# EAGLE design arrayboard_r0 (EAGLE 7.3.0)
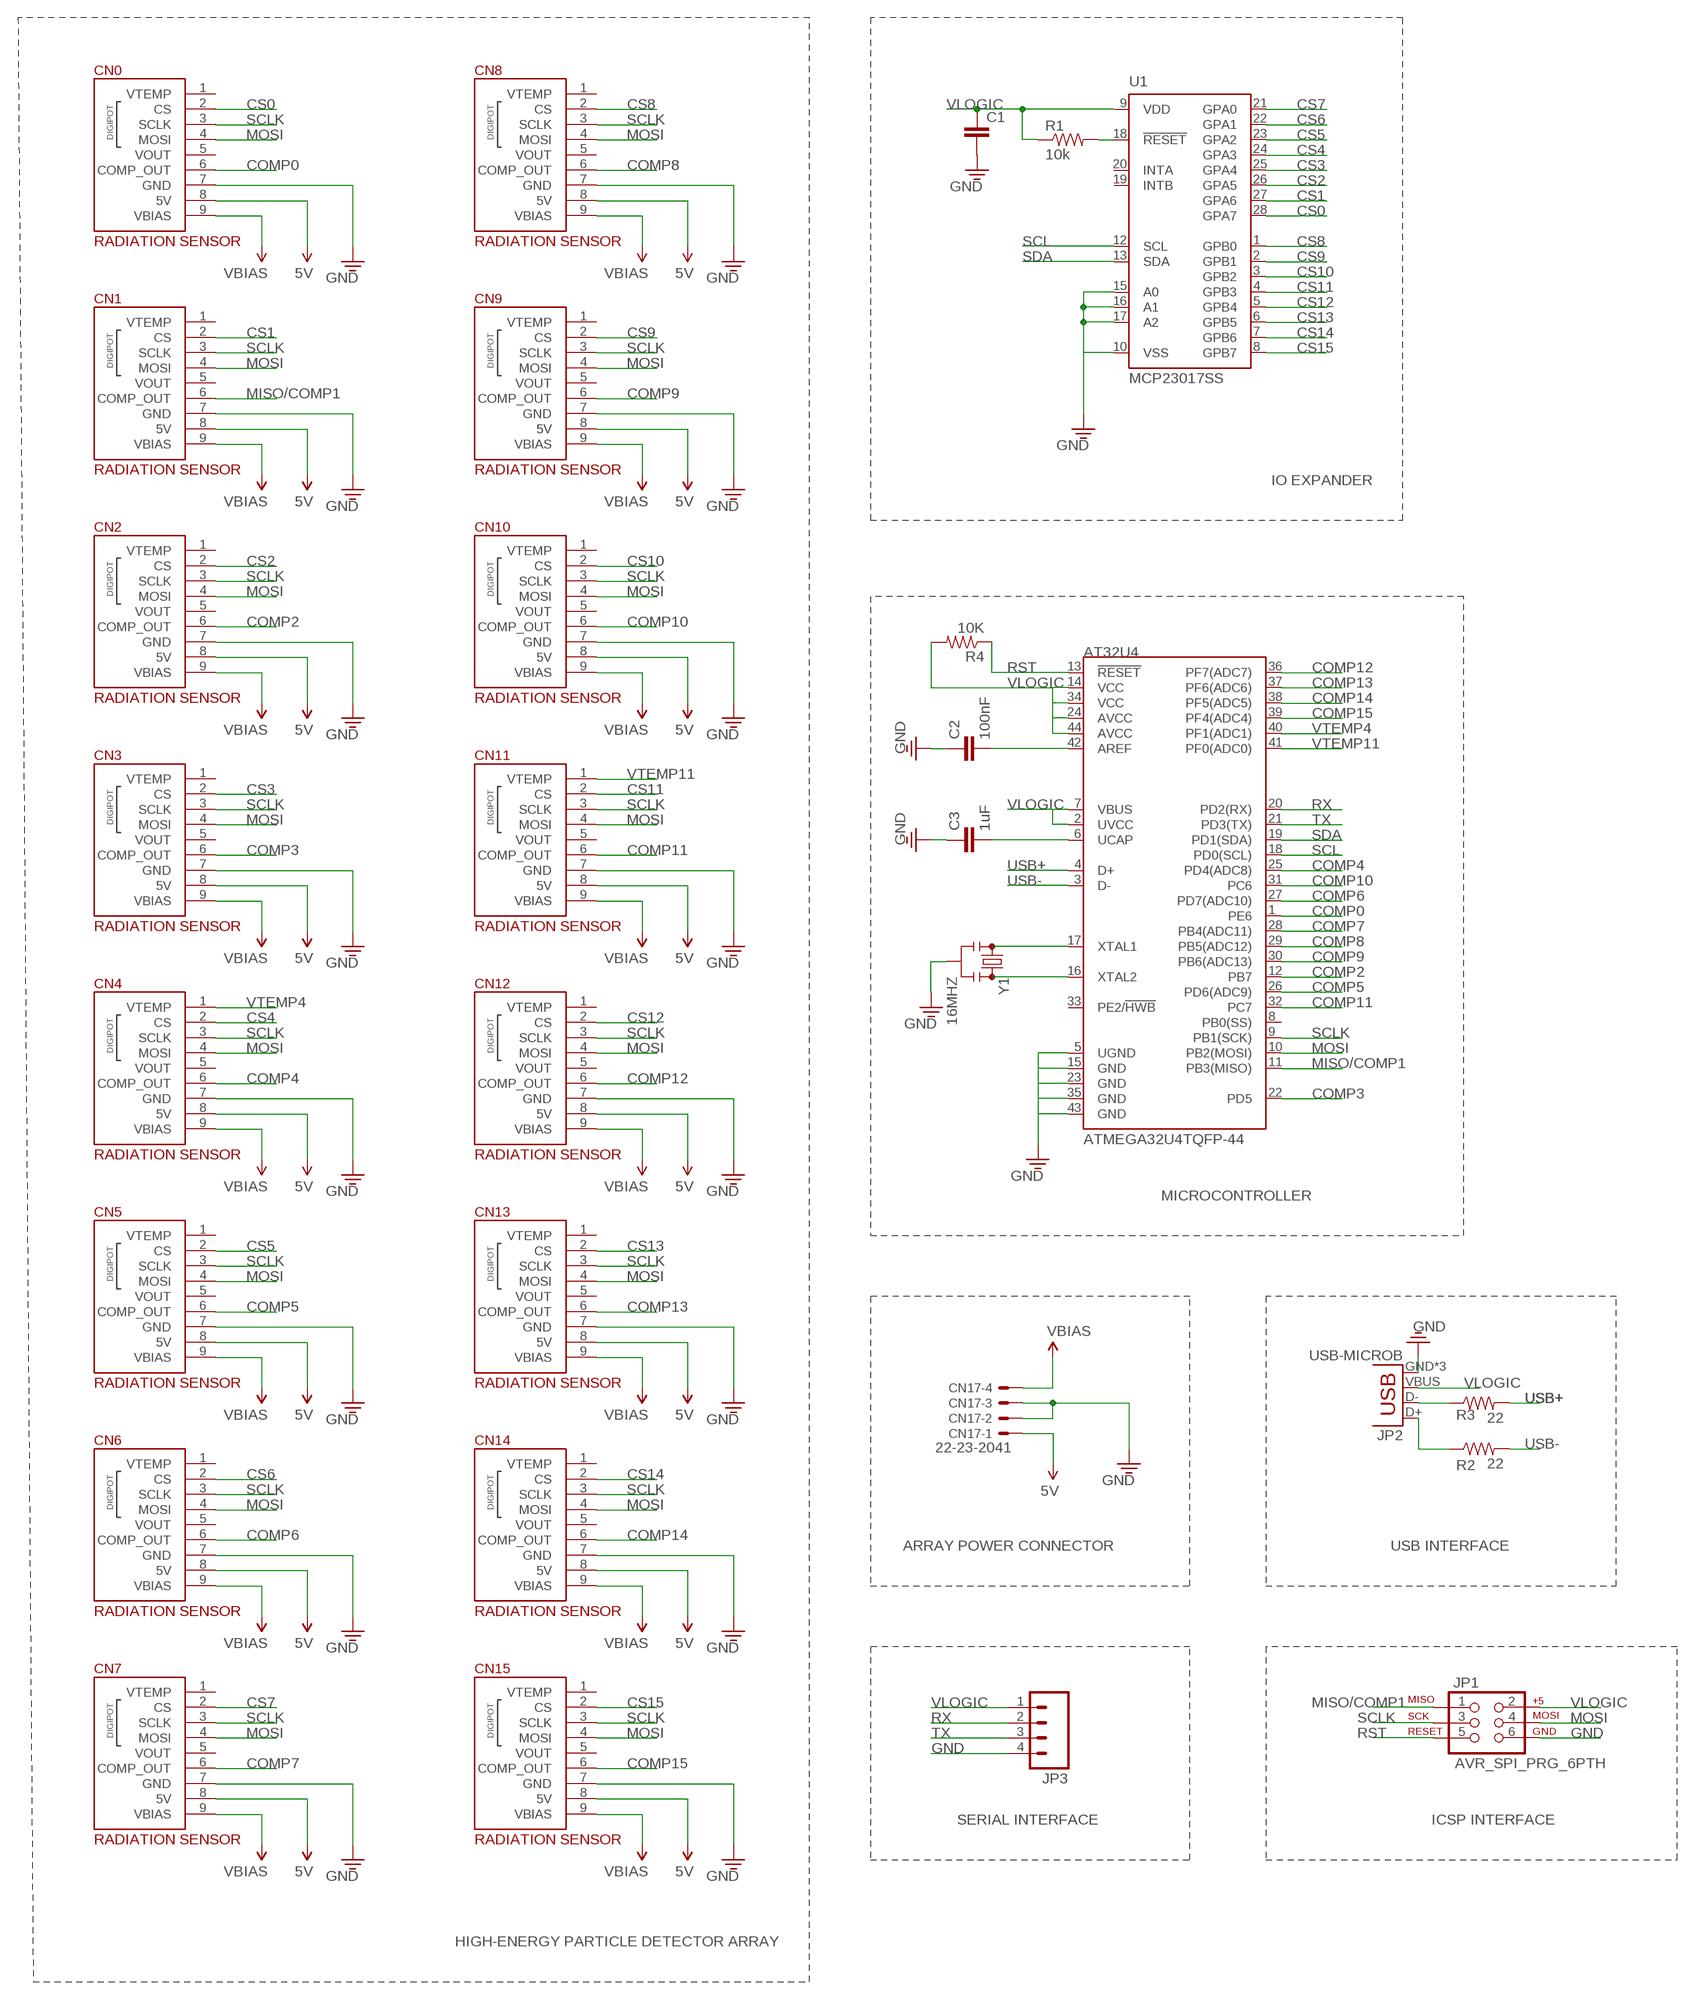
[diagram p0: schematic, sheet 1]

## Parts
AT32U4  ATMEGA32U4TQFP-44  [TQFP44]
C1  CAP0603  [0603]
C2  100nF  CAP0805  [0805]
C3  1uF  CAP0805  [0805]
CN0  RADIATION-SENSOR-REV1  [RADIATION-SENSOR-REV1]
CN1  RADIATION-SENSOR-REV1  [RADIATION-SENSOR-REV1]
CN2  RADIATION-SENSOR-REV1  [RADIATION-SENSOR-REV1]
CN3  RADIATION-SENSOR-REV1  [RADIATION-SENSOR-REV1]
CN4  RADIATION-SENSOR-REV1  [RADIATION-SENSOR-REV1]
CN5  RADIATION-SENSOR-REV1  [RADIATION-SENSOR-REV1]
CN6  RADIATION-SENSOR-REV1  [RADIATION-SENSOR-REV1]
CN7  RADIATION-SENSOR-REV1  [RADIATION-SENSOR-REV1]
CN8  RADIATION-SENSOR-REV1  [RADIATION-SENSOR-REV1]
CN9  RADIATION-SENSOR-REV1  [RADIATION-SENSOR-REV1]
CN10  RADIATION-SENSOR-REV1  [RADIATION-SENSOR-REV1]
CN11  RADIATION-SENSOR-REV1  [RADIATION-SENSOR-REV1]
CN12  RADIATION-SENSOR-REV1  [RADIATION-SENSOR-REV1]
CN13  RADIATION-SENSOR-REV1  [RADIATION-SENSOR-REV1]
CN14  RADIATION-SENSOR-REV1  [RADIATION-SENSOR-REV1]
CN15  RADIATION-SENSOR-REV1  [RADIATION-SENSOR-REV1]
CN17  22-23-2041  [22-23-2041]
JP1  AVR_SPI_PRG_6PTH  [2X3]
JP2  USB-MICROB  [USB-MICROB]
JP3  M04POLAR  [MOLEX-1X4]
R1  10k  RESISTOR0603  [0603]
R2  22  RESISTOR0805-RES  [0805]
R3  22  RESISTOR0805-RES  [0805]
R4  10K  RESISTOR0805-RES  [0805]
U1  MCP23017SS  [SSOP28]
Y1  16MHZ  RESONATOR16MHZ  [RESONATOR-SMD]

## Nets
5V: CN0.8(5V) CN1.8(5V) CN2.8(5V) CN3.8(5V) CN4.8(5V) CN5.8(5V) CN6.8(5V) CN7.8(5V) CN8.8(5V) CN9.8(5V) CN10.8(5V) CN11.8(5V) CN12.8(5V) CN13.8(5V) CN14.8(5V) CN15.8(5V) CN17.1
COMP0: AT32U4.1(PE6) CN0.6(COMP_OUT)
COMP2: AT32U4.12(PB7) CN2.6(COMP_OUT)
COMP3: AT32U4.22(PD5) CN3.6(COMP_OUT)
COMP4: AT32U4.25(PD4(ADC8)) CN4.6(COMP_OUT)
COMP5: AT32U4.26(PD6(ADC9)) CN5.6(COMP_OUT)
COMP6: AT32U4.27(PD7(ADC10)) CN6.6(COMP_OUT)
COMP7: AT32U4.28(PB4(ADC11)) CN7.6(COMP_OUT)
COMP8: AT32U4.29(PB5(ADC12)) CN8.6(COMP_OUT)
COMP9: AT32U4.30(PB6(ADC13)) CN9.6(COMP_OUT)
COMP10: AT32U4.31(PC6) CN10.6(COMP_OUT)
COMP11: AT32U4.32(PC7) CN11.6(COMP_OUT)
COMP12: AT32U4.36(PF7(ADC7)) CN12.6(COMP_OUT)
COMP13: AT32U4.37(PF6(ADC6)) CN13.6(COMP_OUT)
COMP14: AT32U4.38(PF5(ADC5)) CN14.6(COMP_OUT)
COMP15: AT32U4.39(PF4(ADC4)) CN15.6(COMP_OUT)
CS0: CN0.2(CS) U1.28(GPA7)
CS1: CN1.2(CS) U1.27(GPA6)
CS2: CN2.2(CS) U1.26(GPA5)
CS3: CN3.2(CS) U1.25(GPA4)
CS4: CN4.2(CS) U1.24(GPA3)
CS5: CN5.2(CS) U1.23(GPA2)
CS6: CN6.2(CS) U1.22(GPA1)
CS7: CN7.2(CS) U1.21(GPA0)
CS8: CN8.2(CS) U1.1(GPB0)
CS9: CN9.2(CS) U1.2(GPB1)
CS10: CN10.2(CS) U1.3(GPB2)
CS11: CN11.2(CS) U1.4(GPB3)
CS12: CN12.2(CS) U1.5(GPB4)
CS13: CN13.2(CS) U1.6(GPB5)
CS14: CN14.2(CS) U1.7(GPB6)
CS15: CN15.2(CS) U1.8(GPB7)
GND: AT32U4.5(UGND) AT32U4.15(GND) AT32U4.23(GND) AT32U4.35(GND) AT32U4.43(GND) C1.2 C2.1 C3.1 CN0.7(GND) CN1.7(GND) CN2.7(GND) CN3.7(GND) CN4.7(GND) CN5.7(GND) CN6.7(GND) CN7.7(GND) CN8.7(GND) CN9.7(GND) CN10.7(GND) CN11.7(GND) CN12.7(GND) CN13.7(GND) CN14.7(GND) CN15.7(GND) CN17.2 CN17.3 JP1.6 JP2.GND JP2.MT1(GND) JP2.MT2(GND) JP3.4 U1.10(VSS) U1.15(A0) U1.16(A1) U1.17(A2) Y1.2
MISO/COMP1: AT32U4.11(PB3(MISO)) CN1.6(COMP_OUT) JP1.1
MOSI: AT32U4.10(PB2(MOSI)) CN0.4(MOSI) CN1.4(MOSI) CN2.4(MOSI) CN3.4(MOSI) CN4.4(MOSI) CN5.4(MOSI) CN6.4(MOSI) CN7.4(MOSI) CN8.4(MOSI) CN9.4(MOSI) CN10.4(MOSI) CN11.4(MOSI) CN12.4(MOSI) CN13.4(MOSI) CN14.4(MOSI) CN15.4(MOSI) JP1.4
N$1: JP2.D- R3.1
N$2: R1.2 U1.18(!RESET)
N$3: JP2.D+ R2.1
N$4: AT32U4.6(UCAP) C3.2
N$5: AT32U4.17(XTAL1) Y1.1
N$6: AT32U4.2(UVCC)
N$7: AT32U4.16(XTAL2) Y1.3
N$9: AT32U4.42(AREF) C2.2
RST: AT32U4.13(!RESET) JP1.5 R4.1
RX: AT32U4.20(PD2(RX)) JP3.2
SCL: AT32U4.18(PD0(SCL)) U1.12(SCL)
SCLK: AT32U4.9(PB1(SCK)) CN0.3(SCLK) CN1.3(SCLK) CN2.3(SCLK) CN3.3(SCLK) CN4.3(SCLK) CN5.3(SCLK) CN6.3(SCLK) CN7.3(SCLK) CN8.3(SCLK) CN9.3(SCLK) CN10.3(SCLK) CN11.3(SCLK) CN12.3(SCLK) CN13.3(SCLK) CN14.3(SCLK) CN15.3(SCLK) JP1.3
SDA: AT32U4.19(PD1(SDA)) U1.13(SDA)
TX: AT32U4.21(PD3(TX)) JP3.3
USB+: AT32U4.4(D+) R3.2
USB-: AT32U4.3(D-) R2.2
VBIAS: CN0.9(VBIAS) CN1.9(VBIAS) CN2.9(VBIAS) CN3.9(VBIAS) CN4.9(VBIAS) CN5.9(VBIAS) CN6.9(VBIAS) CN7.9(VBIAS) CN8.9(VBIAS) CN9.9(VBIAS) CN10.9(VBIAS) CN11.9(VBIAS) CN12.9(VBIAS) CN13.9(VBIAS) CN14.9(VBIAS) CN15.9(VBIAS) CN17.4
VLOGIC: AT32U4.7(VBUS) AT32U4.14(VCC) AT32U4.24(AVCC) AT32U4.34(VCC) AT32U4.44(AVCC) C1.1 JP1.2 JP2.VBUS JP3.1 R1.1 R4.2 U1.9(VDD)
VTEMP4: AT32U4.40(PF1(ADC1)) CN4.1(VTEMP)
VTEMP11: AT32U4.41(PF0(ADC0)) CN11.1(VTEMP)
Unconnected: AT32U4.8(PB0(SS)) AT32U4.33(PE2/!HWB) CN0.1(VTEMP) CN0.5(VOUT) CN1.1(VTEMP) CN1.5(VOUT) CN2.1(VTEMP) CN2.5(VOUT) CN3.1(VTEMP) CN3.5(VOUT) CN4.5(VOUT) CN5.1(VTEMP) CN5.5(VOUT) CN6.1(VTEMP) CN6.5(VOUT) CN7.1(VTEMP) CN7.5(VOUT) CN8.1(VTEMP) CN8.5(VOUT) CN9.1(VTEMP) CN9.5(VOUT) CN10.1(VTEMP) CN10.5(VOUT) CN11.5(VOUT) CN12.1(VTEMP) CN12.5(VOUT) CN13.1(VTEMP) CN13.5(VOUT) CN14.1(VTEMP) CN14.5(VOUT) CN15.1(VTEMP) CN15.5(VOUT) U1.19(INTB) U1.20(INTA)

## Notes on the sheet
- IO EXPANDER
- MICROCONTROLLER
- ARRAY POWER CONNECTOR | USB INTERFACE
- SERIAL INTERFACE | ICSP INTERFACE
- HIGH-ENERGY PARTICLE DETECTOR ARRAY

## Library data of the parts
AT32U4 = SparkFun-DigitalIC:ATMEGA32U4: Atmel 44-pin 8-bit Microcontroller with 32KBytes of ISP Flash and USB Controller
C1 = openct:CAP: Capacitor Standard 0603 ceramic capacitor, and 0.1" leaded capacitor.
C2 C3 = SparkFun-Passives:CAP: Capacitor Standard 0603 ceramic capacitor, and 0.1" leaded capacitor.
CN0 CN1-CN15 = openct:RADIATION-SENSOR-REV1: Header for Radiation Sensor (rev1)
CN17 = con-molex:22-23-2041: .100" (2.54mm) Center Header - 4 Pin; MF: MOLEX; MPN: 22-23-2041; OC_FARNELL: 1462920; OC_NEWARK: 38C0355
JP1 = SparkFun-Connectors:AVR_SPI_PRG_6: AVR ISP 6 Pin This is the reduced ISP connector for AVR programming. Common on Arduino. This footprint will take up less PCB space and can be used with a 10-pin to 6-pin adapter such as SKU: BOB-08508 **Special note about "TEST_POINT" package. The stop mask is on the top side, so if you want your programming test points to be on the bottom of your board, make sure to place this package on the bottom side of the board. This also ensure that the orientation to program from the bottom side will be correct.
JP2 = SparkFun-Connectors:USB: USB Connectors USB-B-PTH is fully proven SKU : PRT-00139/CONN-08278 USB-miniB is fully proven SKU : PRT-00587 USB-A-PCB is untested. USB-A-H is throughly reviewed, but untested. Spark Fun Electronics SKU : PRT-00437 USB-B-SMT is throughly reviewed, but untested. Needs silkscreen touching up. USB-A-S has not been used/tested USB-MB-H has not been used/tested USB-MICROB has been used. CONN-09505; PROD_ID: CONN-09505
JP3 = SparkFun-Connectors:M04: Header 4 Standard 4-pin 0.1" header. Use with straight break away headers (SKU : PRT-00116), right angle break away headers (PRT-00553), swiss pins (PRT-00743), machine pins (PRT-00117), and female headers (PRT-00115). Molex polarized connector foot print use with SKU : PRT-08231 with associated crimp pins and housings. 1MM SMD Version SKU: PRT-10208
R1 = openct:RESISTOR: Resistor
R2-R4 = SparkFun-Passives:RESISTOR: Resistor
U1 = adafruit:MCP23017: http://ww1.microchip.com/downloads/en/DeviceDoc/21952a.pdf Source: http://ww1.microchip.com/downloads/en/DeviceDoc/21952a.pdf
Y1 = SparkFun-FreqCtrl:RESONATOR: Resonator Small SMD resonator. Used, eg, on the Arduino Pro/ Pro Mini boards. 8MHz- XTAL-08895 16MHz- XTAL-08900; PROD_ID: XTAL-08900

## Board
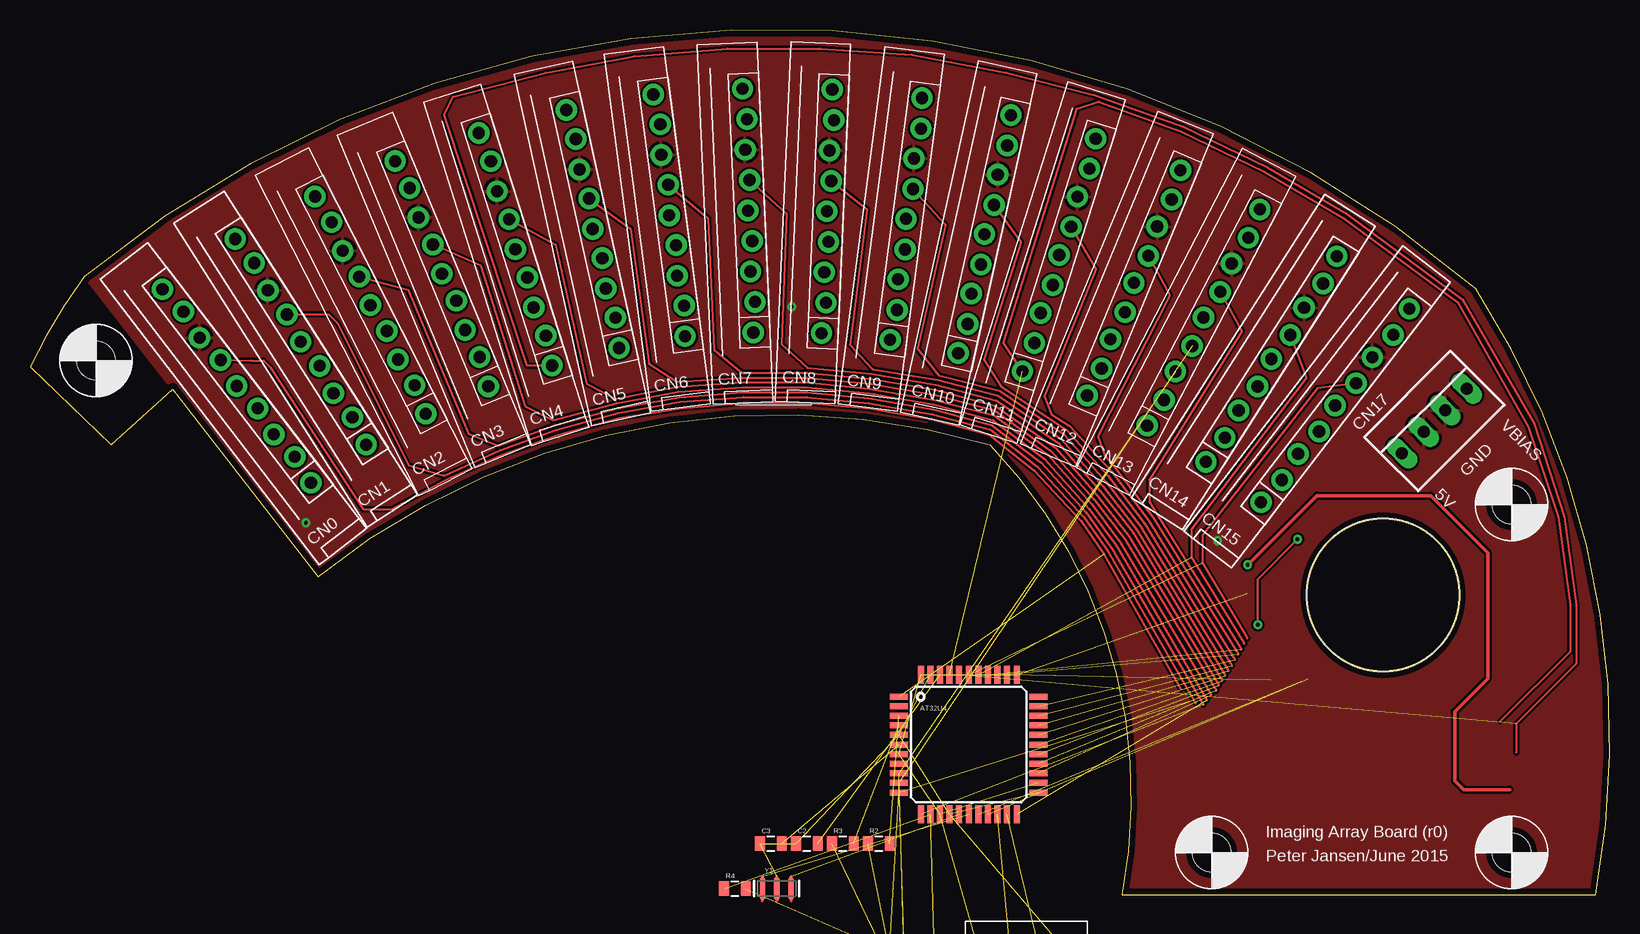
[diagram p1: board, top side]
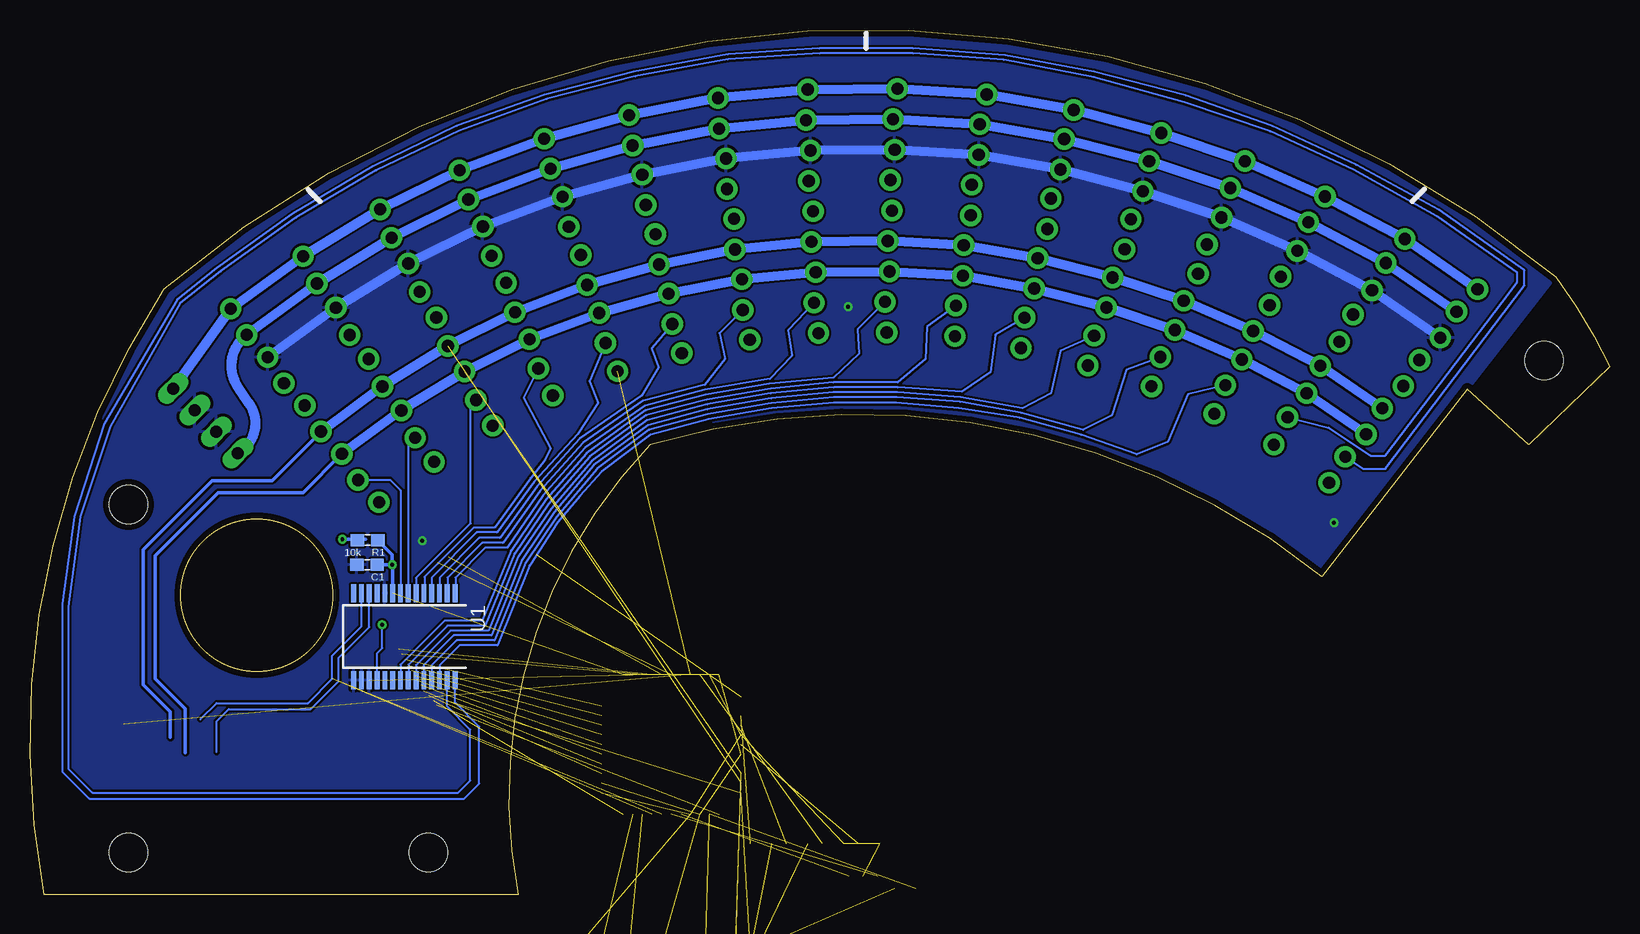
[diagram p2: board, bottom side, seen from below]

Size 131.71 x 72.05 mm. Coordinates in mm from the lower left corner, seen from the top.
Outline: 4.5,51.5 arc10 0,44 6.75,37.5 11.9,42.1 24,26.5 arc-55 80,37.5 arc-55 91,0 130.5,0 arc44 120.5,50.5 arc80 4.5,51.5
Outline: circle at 112.8,24.95 radius 6.35
Copper layers (1*16): Top 0.035mm / dielectric 1.5mm / Bottom 0.035mm
Design rules "default *": minimum track width 7mil, minimum drill 13mil, track to track 7mil, track to pad 8mil, pad to pad 8mil, via to via 8mil, smd to smd 8mil, copper to edge 20mil, drill to drill 8mil, minimum pad ring 10mil, minimum via ring 8mil, stop-mask expansion 4mil, vias tented up to drill 0mil, thermal gap 10mil
tKeepout: area 106.5,18.6 to 119.1,31.3
bKeepout: area 106.5,18.6 to 119.1,31.3; area 106.5,18.6 to 119.1,31.3; area 106.5,18.6 to 119.1,31.3
bRestrict: area 106.5,18.6 to 119.1,31.3

### Footprints (pad centres in the part's own frame; a part is rotated, then mirrored left to right if it is on the bottom)
TQFP44 = smd 1.5 x 0.5: 1 -5.8,4; 2 -5.8,3.2; 3 -5.8,2.4; 4 -5.8,1.6; 5 -5.8,0.8; 6 -5.8,0; 7 -5.8,-0.8; 8 -5.8,-1.6; 9 -5.8,-2.4; 10 -5.8,-3.2; 11 -5.8,-4; 23 5.8,-4; 24 5.8,-3.2; 25 5.8,-2.4; 26 5.8,-1.6; 27 5.8,-0.8; 28 5.8,0; 29 5.8,0.8; 30 5.8,1.6; 31 5.8,2.4; 32 5.8,3.2; 33 5.8,4 | smd 0.5 x 1.5: 12 -4,-5.8; 13 -3.2,-5.8; 14 -2.4,-5.8; 15 -1.6,-5.8; 16 -0.8,-5.8; 17 0,-5.8; 18 0.8,-5.8; 19 1.6,-5.8; 20 2.4,-5.8; 21 3.2,-5.8; 22 4,-5.8; 34 4,5.8; 35 3.2,5.8; 36 2.4,5.8; 37 1.6,5.8; 38 0.8,5.8; 39 0,5.8; 40 -0.8,5.8; 41 -1.6,5.8; 42 -2.4,5.8; 43 -3.2,5.8; 44 -4,5.8
0603 = smd 1.1 x 1: 1 -0.85,0; 2 0.85,0
0805 = smd 0.8 x 1.2: 1 -0.9,0; 2 0.9,0
RADIATION-SENSOR-REV1 = drill 1.016 pad 1.778: 1 9.16,1.123; 2 6.62,1.377; 3 4.08,1.123; 4 1.54,1.377; 5 -1,1.123; 6 -3.54,1.377; 7 -6.08,1.123; 8 -8.62,1.377; 9 -11.16,1.123
22-23-2041 = drill 1 long: 1 -3.81,0; 2 -1.27,0; 3 1.27,0; 4 3.81,0
2X3 = drill 1.016 pad 1.88 octagon: 1 0,0; 2 0,2.54; 3 2.54,0; 4 2.54,2.54; 5 5.08,0; 6 5.08,2.54
USB-MICROB = smd 0.35 x 1.4: D+ 0,2.65; D- -0.65,2.65; GND 1.3,2.65; ID 0.65,2.65; VBUS -1.3,2.65 | smd 1.8 x 1.9: MT1 -4,0; MT2 4,0 | smd 1.9 x 1.9: P$1 -1.27,0; P$2 1.27,0
MOLEX-1X4 = drill 1.016 pad 1.88 square: 1 0,0 | drill 1.016 pad 1.88: 2 2.54,0; 3 5.08,0; 4 7.62,0
SSOP28 = smd 0.4 x 1.5: 1 -4.225,-3.625; 2 -3.575,-3.625; 3 -2.925,-3.625; 4 -2.275,-3.625; 5 -1.625,-3.625; 6 -0.975,-3.625; 7 -0.325,-3.625; 8 0.325,-3.625; 9 0.975,-3.625; 10 1.625,-3.625; 11 2.275,-3.625; 12 2.925,-3.625; 13 3.575,-3.625; 14 4.225,-3.625; 15 4.225,3.625; 16 3.575,3.625; 17 2.925,3.625; 18 2.275,3.625; 19 1.625,3.625; 20 0.975,3.625; 21 0.325,3.625; 22 -0.325,3.625; 23 -0.975,3.625; 24 -1.625,3.625; 25 -2.275,3.625; 26 -2.925,3.625; 27 -3.575,3.625; 28 -4.225,3.625
MOUNT-M3 = hole 3.2: 0,0
RESONATOR-SMD = smd 0.45 x 1.905: 1 -1.2,0; 2 0,0; 3 1.2,0

### Placement (x,y rotation side)
AT32U4  78.25,12.5 0 top
C1  103.61,27.49 180 bottom
C2  64.75,4.25 0 top
C3  61.75,4.25 0 top
CN0  16.95,40.9 307.5 top
CN1  22.15,44.62 302.5 top
CN2  27.83,47.72 297 top
CN3  33.67,50.38 292.5 top
CN4  39.69,52.48 287.5 top
CN5  46.02,54.25 282.5 top
CN6  52.3,55.47 277.5 top
CN7  58.77,55.95 272.5 top
CN8  65.26,55.99 267.5 top
CN9  71.78,55.47 262.5 top
CN10  78.26,54.3 257.5 top
CN11  84.41,52.69 252.5 top
CN12  90.6,50.48 247.5 top
CN13  96.37,47.72 242.5 top
CN14  102,44.39 237.5 top
CN15  107.3,40.64 232.5 top
CN17  117.07,39.47 45 top
JP1  70.75,-19.5 0 top  (outside the outline)
JP2  71.5,-6.75 0 top  (outside the outline)
JP3  79.25,-5.25 0 top  (outside the outline)
R1  103.56,29.54 180 bottom
R2  70.75,4.25 0 top
R3  67.75,4.25 0 top
R4  58.75,0.5 0 top
U1  100.5,21.5 180 bottom
U$35  [MOUNT-M3]  123.5,3.5 0 top
U$36  [MOUNT-M3]  98.5,3.5 0 top
U$37  [MOUNT-M3]  123.5,32.5 0 top
U$38  [MOUNT-M3]  5.5,44.5 0 top
Y1  62.25,0.5 0 top

### Tracks (layer width: path | path; a pad name or v marks a point on that pad's centre or on a via)
5V
  Bottom 0.8: CN0.8 CN1.8 CN2.8 CN3.8 CN4.8 CN5.8 CN6.8 CN7.8 CN8.8 CN9.8 CN10.8 CN11.8 CN12.8 CN13.8 CN14.8 CN15.8
  Bottom 0.813: CN15.8 arc-84 114.5,42.5 arc-7 113.5,41 arc97 CN17.1
COMP0  (1 unrouted)
  Top 0.178: CN0.6 18.42,44.5 19.49,44.5 20.04,43.95 27.76,32.11 30.15,32.11 34.67,34.55 39.34,36.63 44.07,38.31 49.2,39.73 54.28,40.55 59.51,41 64.69,41 69.92,40.55 75.16,39.63 79.98,38.31 83.69,35.36 87.6,31.15 89.53,28.35 95.93,17.13
COMP2  (1 unrouted)
  Top 0.178: CN2.6 31.52,50.4 36.55,38.41 39.04,37.4 43.76,39.12 48.99,40.55 54.13,41.46 59.41,41.87 64.74,41.87 69.92,41.36 75.26,40.44 80.19,39.12 84.3,35.97 88.01,31.86 90.19,28.81 97.81,15.81
COMP3  (1 unrouted)
  Top 0.178: CN3.6 37.56,52.43 41.27,40.7 43.61,39.53 48.89,40.95 54.02,41.92 59.36,42.27 64.69,42.27 69.98,41.77 75.26,40.85 80.29,39.53 84.56,36.33 88.26,32.16 90.55,29.06 98.12,16.21
COMP4  (1 unrouted)
  Top 0.178: CN4.6 43.81,54.16 46.4,42.58 48.79,41.31 53.92,42.32 59.36,42.68 64.74,42.68 69.98,42.17 75.31,41.26 80.34,39.94 84.86,36.63 88.47,32.57 90.91,29.32 98.47,16.62
COMP5  (1 unrouted)
  Top 0.178: CN5.6 50.06,55.48 51.59,44.25 53.92,42.73 59.36,43.09 64.74,43.09 70.08,42.58 75.41,41.66 80.39,40.34 85.17,36.94 88.67,32.93 91.26,29.62 98.88,16.97
COMP6  (1 unrouted)
  Top 0.178: CN6.6 56.51,56.34 57.02,45.42 59.36,43.49 64.74,43.49 70.08,42.98 75.46,42.07 80.44,40.75 85.42,37.29 88.92,33.28 91.62,29.88 99.08,17.43
COMP7  (1 unrouted)
  Top 0.178: CN7.6 63.07,56.75 62.66,45.88 64.79,43.9 70.13,43.39 75.51,42.48 80.59,41.16 85.67,37.65 89.18,33.64 91.92,30.18 99.39,17.84
COMP8  (1 unrouted)
  Top 0.178: CN8.6 69.77,57.11 68.35,45.83 70.23,43.8 75.67,42.88 80.75,41.56 85.93,38.01 89.43,34.04 92.23,30.44 99.64,18.24
COMP9  (1 unrouted)
  Top 0.178: CN9.6 76.33,55.84 73.99,45.47 75.72,43.29 80.85,41.97 86.18,38.36 89.69,34.4 92.58,30.69 99.9,18.65
COMP10  (1 unrouted)
  Top 0.178: CN10.6 82.62,54.36 79.53,44.56 80.95,42.37 86.38,38.72 89.84,34.91 92.89,30.94 100.2,19.06
COMP11  (1 unrouted)
  Top 0.178: CN11.6 88.87,52.13 84.56,41.51 85.17,40.04 86.64,39.07 90.14,35.26 93.24,31.2 100.46,19.56
COMP12  (1 unrouted)
  Top 0.178: CN12.6 95.02,49.94 89.03,38.21 89.58,36.58 90.45,35.57 93.6,31.45 100.71,20.02
COMP13  (1 unrouted)
  Top 0.178: CN13.6 101.01,46.95 93.29,34.55 93.29,32.72 93.95,31.71 100.96,20.43
COMP14  (1 unrouted)
  Top 0.178: CN14.6 106.4,43.09 96.8,30.44 96.8,28.1 101.22,20.89
COMP15  (1 unrouted)
  Top 0.178: CN15.6 107.3,42.19 97.71,29.93 97.71,27.64 101.47,21.34
CS0
  Bottom 0.178: CN0.2 20.55,35.47 18.72,35.47 7.14,50.76 7.14,52.03 14.25,57.06 21.16,60.81 28.17,64.07 35.38,66.61 43,68.59 50.42,69.96 58.09,70.52 65.91,70.52 73.53,70.01 81.41,68.59 88.82,66.66 96.14,64.07 103.1,60.71 109.8,56.75 116.15,52.18 119.45,49.59 125.5,39.25 128,31.5 129,24.25 129,10.25 126.75,8 95.5,8 94.25,9.25 94.25,14 96.28,16.02 U1.28
CS1
  Bottom 0.178: CN1.2 23.44,38.92 19.94,36.58 18.72,36.58 8.3,50.25 7.75,51.01 7.75,51.82 14.45,56.55 21.36,60.41 28.32,63.61 35.48,66.05 43,68.13 50.52,69.55 58.09,70.11 65.86,70.11 73.53,69.6 81.25,68.18 88.62,66.3 95.93,63.66 102.84,60.36 109.55,56.39 115.8,51.92 119.2,49.28 125,39 127.5,31.5 128.5,24 128.5,10.5 126.5,8.5 96,8.5 95,9.5 95,13.75 96.92,15.67 U1.27
CS2
  Bottom 0.178: CN2.2 35.18,41.71 36.85,37.75 39.45,36.69 44.07,38.31 49.2,39.73 54.28,40.55 59.51,41 64.69,41 69.87,40.55 75.16,39.63 79.98,38.31 84.06,35.23 85.83,33.25 87.71,31.01 90.07,27.41 92.73,20.76 95.91,20.76 97.56,19.11 97.56,17.89 U1.26
CS3
  Bottom 0.178: CN3.2 40.31,43.75 41.53,39.94 43.91,38.72 49.1,40.14 54.18,41.05 59.46,41.46 64.69,41.46 69.92,40.95 75.21,40.04 80.08,38.72 84.45,35.47 87.81,31.5 90.4,27.64 92.99,21.19 96.14,21.19 98.22,19.11 U1.25
CS4
  Bottom 0.178: CN4.2 45.8,45.32 46.61,41.77 48.99,40.55 54.13,41.46 59.41,41.87 64.74,41.87 69.92,41.36 75.26,40.44 80.19,39.12 84.71,35.77 88.01,31.86 90.7,27.9 93.24,21.6 96.39,21.6 98.88,19.11 U1.24
CS5
  Bottom 0.178: CN5.2 51.23,46.64 51.64,43.54 54.02,41.92 59.36,42.27 64.69,42.27 69.98,41.77 75.26,40.85 80.29,39.53 84.89,36.13 88.26,32.16 91.01,28.15 93.5,22 96.65,22 99.53,19.12 U1.23
CS6
  Bottom 0.178: CN6.2 56.92,47.3 57.07,44.61 59.36,42.68 64.74,42.68 69.98,42.17 75.31,41.26 80.34,39.94 85.06,36.48 88.47,32.57 91.31,28.4 93.75,22.41 96.9,22.41 100.15,19.16 100.15,17.9 U1.22
CS7
  Bottom 0.178: CN7.2 62.71,47.1 62.61,45.07 64.74,43.09 70.08,42.58 75.41,41.66 80.39,40.34 85.32,36.79 88.67,32.93 91.62,28.66 94,22.82 97.15,22.82 100.81,19.16 100.81,17.89 U1.21
CS8
  Bottom 0.178: CN8.2 68.5,47.05 68.2,44.91 70.03,42.98 75.46,42.07 80.44,40.75 85.42,37.24 88.92,33.28 91.92,28.91 93.75,28.91 96.24,26.42 96.24,25.16 U1.1
CS9
  Bottom 0.178: CN9.2 74.24,46.79 73.79,44.66 75.46,42.48 80.59,41.16 85.62,37.65 89.18,33.64 92.28,29.32 94,29.32 96.9,26.42 96.9,25.15 U1.2
CS10
  Bottom 0.178: CN10.2 79.88,45.52 79.32,43.95 80.75,41.56 85.88,38.01 89.43,34.04 92.53,29.73 94.26,29.73 97.56,26.42 97.56,25.14 U1.3
CS11
  Bottom 0.178: CN11.2 85.06,42.78 84.35,41 86.08,38.36 89.69,34.4 92.78,30.18 94.46,30.18 98.22,26.42 U1.4
CS12
  Bottom 0.178: CN12.2 90.55,41.41 88.31,37.19 88.77,36.23 89.99,34.7 92.99,30.59 94.72,30.59 98.83,26.47 98.83,25.17 U1.5
CS13
  Bottom 0.178: U1.6 99.53,26.39 94.97,30.94 94.97,40.77 CN13.2
CS14
  Bottom 0.178: CN14.2 100.17,37.49 U1.7
CS15
  Bottom 0.178: CN15.2 101.68,34.55 100.81,33.69 100.81,25.14 U1.8
GND  (via drill 0.33)  (13 unrouted)
  Bottom 0.8: CN0.7 CN1.7 CN2.7 CN3.7 CN4.7 CN5.7 CN6.7 CN7.7 CN8.7 CN9.7 CN10.7 CN11.7 CN12.7 CN13.7 CN14.7 CN15.7
  other vias: 23,31 63.5,49 99,29.5
  pour Top: 4.5,51.5 24,26.5 arc-55 80,37.5 arc-55 91,0 130.5,0 arc44 120.5,50.5 arc80
  pour Bottom: 4.5,51.5 24,26.5 arc-55 80,37.5 arc-55 91,0 130.5,0 arc44 120.5,50.5 arc80
MISO/COMP1  (2 unrouted)
  Top 0.178: CN1.6 24.89,48.34 25.63,47.61 31.57,35.77 34.52,34.91 39.19,37.04 43.91,38.72 49.1,40.14 54.18,41.05 59.46,41.46 64.74,41.46 69.92,40.95 75.21,40.04 80.08,38.72 84,35.67 87.86,31.45 89.84,28.61 97,16.21 arc5 97.18,15.93
MOSI  (2 unrouted)
  Bottom 0.305: CN15.4 111.54,34.5 116.5,34.5 122.25,28.75 122.25,17.5 120,15.25 120,13.11
  Bottom 0.8: CN0.4 CN1.4 CN2.4 CN3.4 CN4.4 CN5.4 CN6.4 CN7.4 CN8.4 CN9.4 CN10.4 CN11.4 CN12.4 CN13.4 CN14.4 CN15.4
N$1  (1 unrouted)
N$2  (via drill 0.33)
  Top 0.178: v102.36,22.49 102.36,26.3 v105.66,29.6
  Bottom 0.178: U1.18 102.78,20.09 102.33,20.53 102.33,22.22 v102.36,22.49
  Bottom 0.305: R1.2 103.72,29.6 v105.66,29.6
N$3  (1 unrouted)
N$4  (1 unrouted)
N$5  (1 unrouted)
N$7  (1 unrouted)
N$9  (1 unrouted)
RST  (2 unrouted)
RX  (1 unrouted)
SCL  (1 unrouted)
  Bottom 0.178: 116.15,11.88 116.15,14.43 115.14,15.45 108.33,15.45 105.99,17.79 105.99,19.72 103.42,22.28 U1.12
SCLK  (2 unrouted)
  Bottom 0.305: CN15.3 108.93,33.5 116,33.5 121.25,28.25 121.25,18 118.75,15.5 118.75,11.82
  Bottom 0.8: CN0.3 CN1.3 CN2.3 CN3.3 CN4.3 CN5.3 CN6.3 CN7.3 CN8.3 CN9.3 CN10.3 CN11.3 CN12.3 CN13.3 CN14.3 CN15.3
SDA  (1 unrouted)
  Bottom 0.178: 117.5,14.61 116.15,15.96 108.53,15.96 106.5,17.99 106.5,19.92 104.06,22.36 104.06,25.11 U1.13
TX  (1 unrouted)
USB+  (1 unrouted)
USB-  (1 unrouted)
VBIAS
  Bottom 0.8: CN15.9 CN14.9 CN13.9 CN12.9 CN11.9 CN10.9 CN9.9 CN8.9 CN7.9 CN6.9 CN5.9 CN4.9 CN3.9 CN2.9 CN1.9 CN0.9
  Bottom 0.813: CN15.9 CN17.4
VLOGIC  (via drill 0.33)  (9 unrouted)
  Top 0.305: 123.34,8.75 119.5,8.75 118.75,9.5 118.75,15.25 121.5,18 121.5,28.5 116.75,33.25 107.25,33.25 v101.5,27.5
  Bottom 0.305: U1.9 101.47,27.48 v101.5,27.5 | v101.5,27.5 101.5,28.33 R1.1 | C1.1 101.99,27.49 v101.5,27.5
VTEMP4  (1 unrouted)
  Top 0.178: CN4.1 41.42,44.08 34.5,65 35.25,66.5 43,68.5 50.38,69.88 58.12,70.5 65.88,70.5 73.5,70 81.38,68.5 88.75,66.62 96.12,64 103.12,60.62 109.75,56.75 119.38,49.62 125.38,39.25 127.88,31.5 128.88,24.12 128.88,19.25 123.88,14.25 123.88,11.82
VTEMP11  (1 unrouted)
  Top 0.178: CN11.1 81.12,46 87.25,65.5 89.07,66.07 95.88,63.62 102.88,60.25 109.5,56.38 119,49.38 124.88,39 127.38,31.5 128.38,24.12 128.38,20.25 122.58,14.45

### Text on the board
tPlace: VBIAS | GND | 5V | Imaging Array Board (r0) | Peter Jansen/June 2015